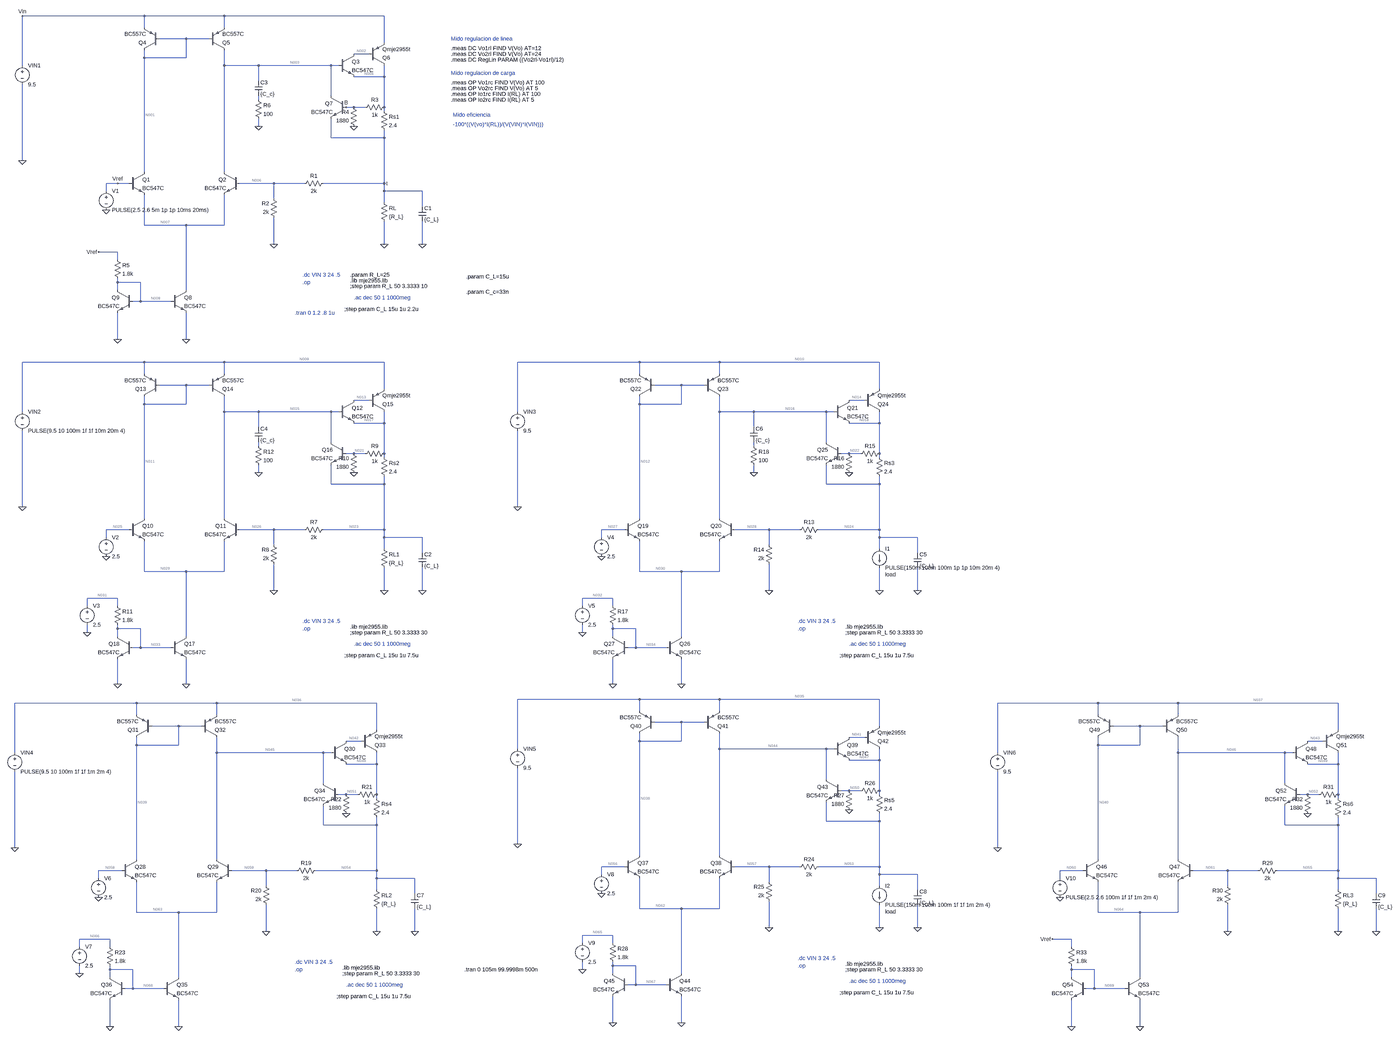
[diagram p0: schematic segundo_check_3.asc, whole sheet]
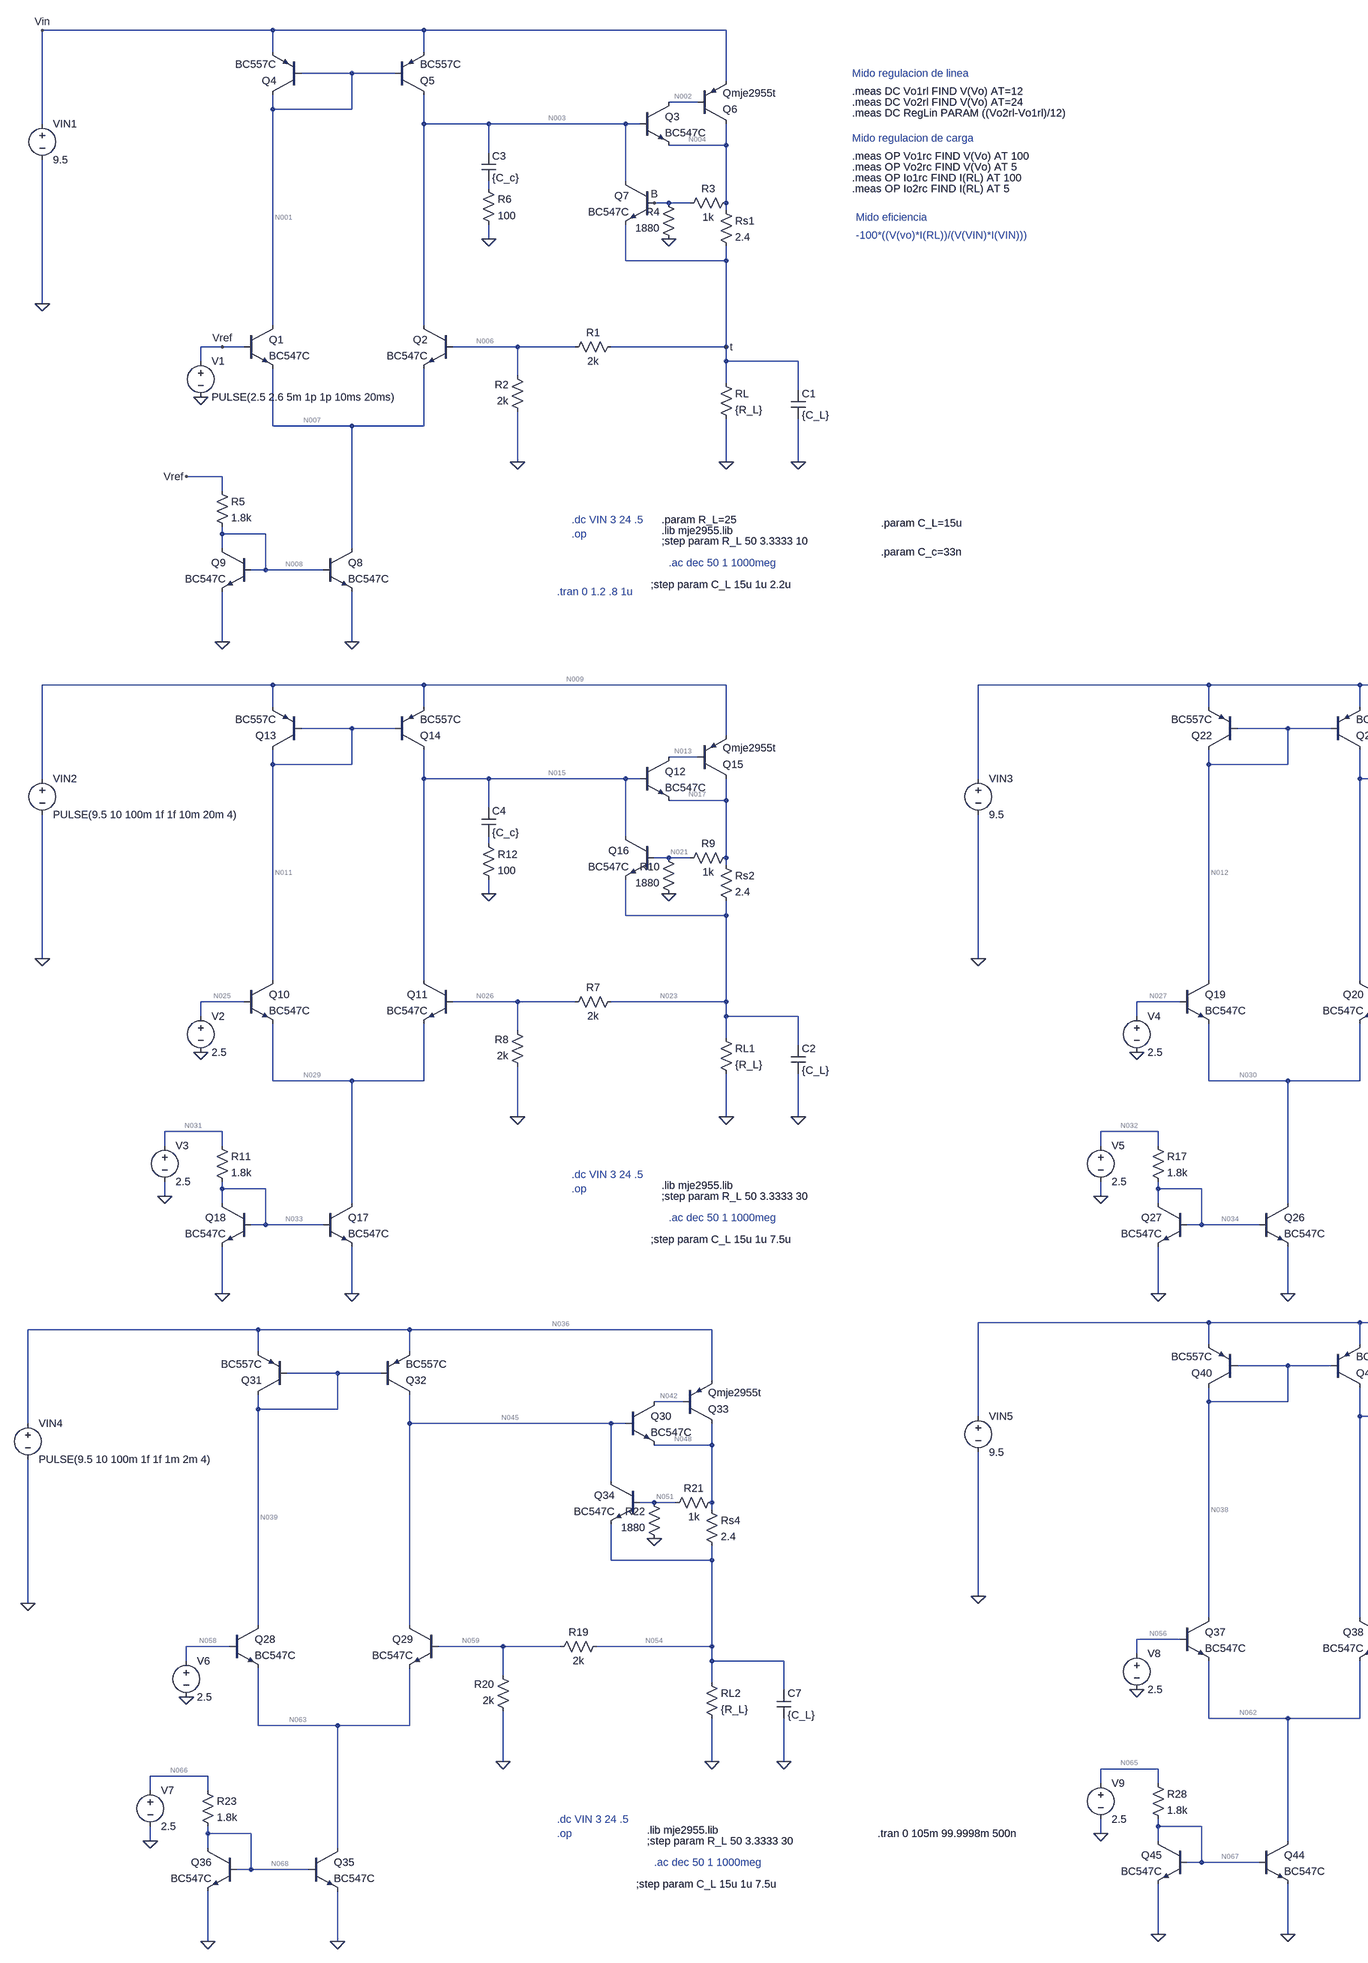
[diagram p1: schematic segundo_check_3.asc, part, row 1 of 1, column 1 of 2]
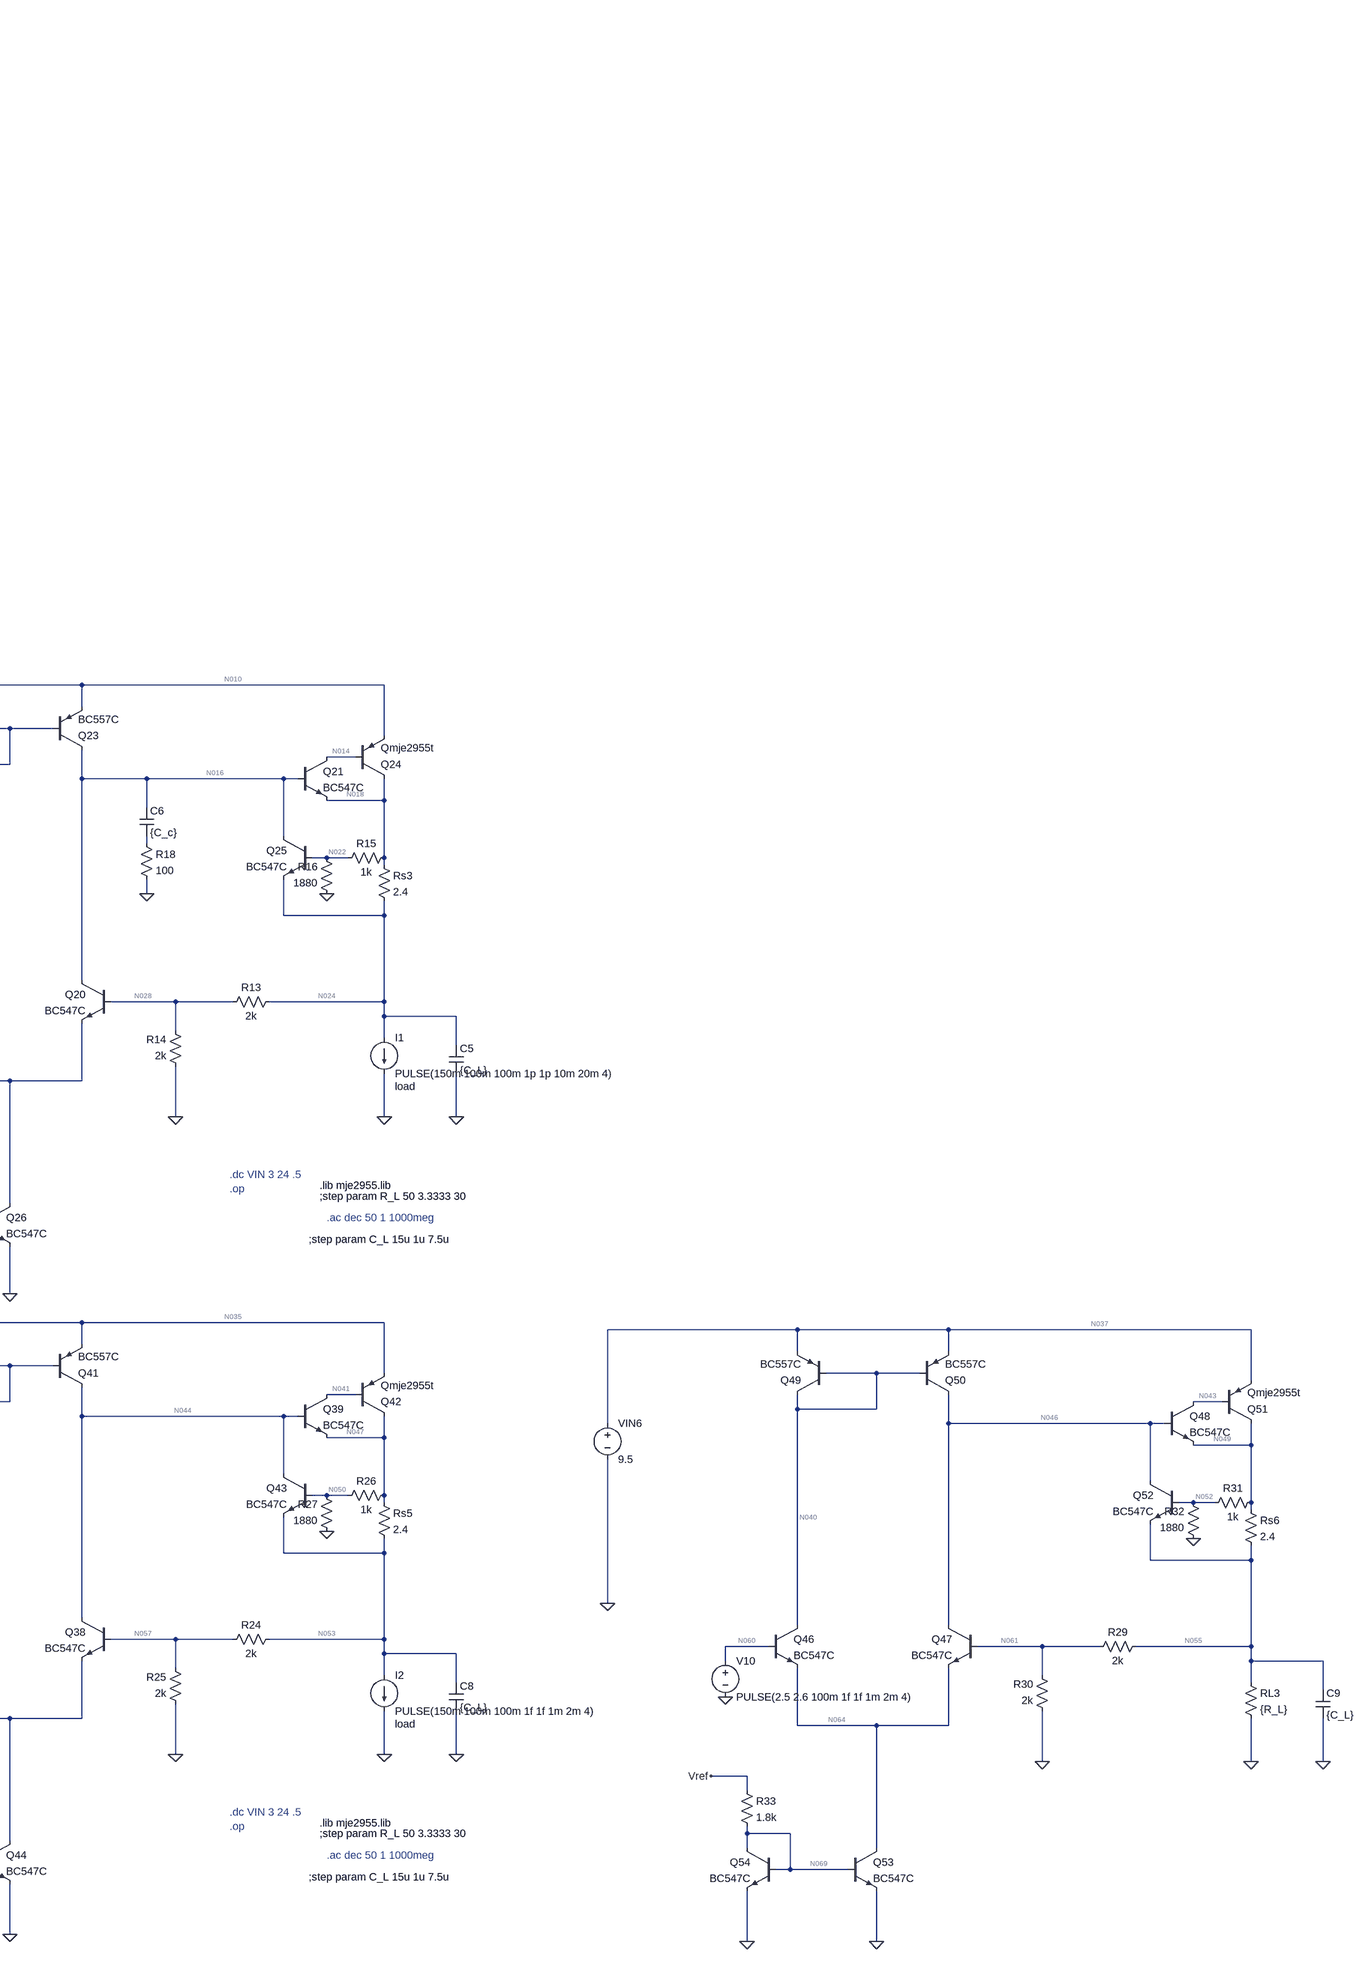
[diagram p2: schematic segundo_check_3.asc, part, row 1 of 1, column 2 of 2]
segundo_check_3.asc, the LTspice schematic file:
Version 4.1
SHEET 1 5268 3924
WIRE -80 -352 -592 -352
WIRE 256 -352 -80 -352
WIRE 928 -352 256 -352
WIRE -80 -304 -80 -352
WIRE 256 -304 256 -352
WIRE 96 -256 -16 -256
WIRE 192 -256 96 -256
WIRE 928 -240 928 -352
WIRE 864 -192 800 -192
WIRE -80 -176 -80 -208
WIRE 96 -176 96 -256
WIRE 96 -176 -80 -176
WIRE -592 -144 -592 -352
WIRE 256 -144 256 -208
WIRE 400 -144 256 -144
WIRE 704 -144 400 -144
WIRE 736 -144 704 -144
WIRE 928 -96 928 -144
WIRE 928 -96 800 -96
WIRE 400 -80 400 -144
WIRE 704 -16 704 -144
WIRE 400 0 400 -16
WIRE 800 32 768 32
WIRE 848 32 800 32
WIRE 928 32 928 -96
WIRE 928 48 928 32
WIRE 400 112 400 80
WIRE 704 160 704 80
WIRE 928 160 928 128
WIRE 928 160 704 160
WIRE -592 256 -592 -64
WIRE -80 304 -80 -176
WIRE 256 304 256 -144
WIRE -192 352 -240 352
WIRE -144 352 -192 352
WIRE 464 352 320 352
WIRE 592 352 464 352
WIRE 928 352 928 160
WIRE 928 352 672 352
WIRE -240 384 -240 352
WIRE 928 384 928 352
WIRE 1088 384 928 384
WIRE 464 416 464 352
WIRE 928 432 928 384
WIRE 1088 448 1088 384
WIRE -80 528 -80 400
WIRE 96 528 -80 528
WIRE 256 528 256 400
WIRE 256 528 96 528
WIRE 464 608 464 496
WIRE 928 608 928 512
WIRE 1088 608 1088 512
WIRE -192 640 -272 640
WIRE -192 672 -192 640
WIRE -192 768 -192 752
WIRE -96 768 -192 768
WIRE -192 800 -192 768
WIRE 96 800 96 528
WIRE -96 848 -96 768
WIRE -96 848 -128 848
WIRE 32 848 -96 848
WIRE -192 1008 -192 896
WIRE 96 1008 96 896
WIRE -80 1104 -592 1104
WIRE 256 1104 -80 1104
WIRE 928 1104 256 1104
WIRE 2000 1104 1488 1104
WIRE 2336 1104 2000 1104
WIRE 3008 1104 2336 1104
WIRE -80 1152 -80 1104
WIRE 256 1152 256 1104
WIRE 2000 1152 2000 1104
WIRE 2336 1152 2336 1104
WIRE 96 1200 -16 1200
WIRE 192 1200 96 1200
WIRE 2176 1200 2064 1200
WIRE 2272 1200 2176 1200
WIRE 928 1216 928 1104
WIRE 3008 1216 3008 1104
WIRE 864 1264 800 1264
WIRE 2944 1264 2880 1264
WIRE -80 1280 -80 1248
WIRE 96 1280 96 1200
WIRE 96 1280 -80 1280
WIRE 2000 1280 2000 1248
WIRE 2176 1280 2176 1200
WIRE 2176 1280 2000 1280
WIRE -592 1312 -592 1104
WIRE 256 1312 256 1248
WIRE 400 1312 256 1312
WIRE 704 1312 400 1312
WIRE 736 1312 704 1312
WIRE 1488 1312 1488 1104
WIRE 2336 1312 2336 1248
WIRE 2480 1312 2336 1312
WIRE 2784 1312 2480 1312
WIRE 2816 1312 2784 1312
WIRE 928 1360 928 1312
WIRE 928 1360 800 1360
WIRE 3008 1360 3008 1312
WIRE 3008 1360 2880 1360
WIRE 400 1376 400 1312
WIRE 2480 1376 2480 1312
WIRE 704 1440 704 1312
WIRE 2784 1440 2784 1312
WIRE 400 1456 400 1440
WIRE 2480 1456 2480 1440
WIRE 800 1488 768 1488
WIRE 848 1488 800 1488
WIRE 928 1488 928 1360
WIRE 2880 1488 2848 1488
WIRE 2928 1488 2880 1488
WIRE 3008 1488 3008 1360
WIRE 928 1504 928 1488
WIRE 3008 1504 3008 1488
WIRE 400 1568 400 1536
WIRE 2480 1568 2480 1536
WIRE 704 1616 704 1536
WIRE 928 1616 928 1584
WIRE 928 1616 704 1616
WIRE 2784 1616 2784 1536
WIRE 3008 1616 3008 1584
WIRE 3008 1616 2784 1616
WIRE -592 1712 -592 1392
WIRE 1488 1712 1488 1392
WIRE -80 1760 -80 1280
WIRE 256 1760 256 1312
WIRE 2000 1760 2000 1280
WIRE 2336 1760 2336 1312
WIRE -144 1808 -240 1808
WIRE 464 1808 320 1808
WIRE 592 1808 464 1808
WIRE 928 1808 928 1616
WIRE 928 1808 672 1808
WIRE 1936 1808 1840 1808
WIRE 2544 1808 2400 1808
WIRE 2672 1808 2544 1808
WIRE 3008 1808 3008 1616
WIRE 3008 1808 2752 1808
WIRE -240 1840 -240 1808
WIRE 928 1840 928 1808
WIRE 1088 1840 928 1840
WIRE 1840 1840 1840 1808
WIRE 3008 1840 3008 1808
WIRE 3168 1840 3008 1840
WIRE 464 1872 464 1808
WIRE 2544 1872 2544 1808
WIRE 928 1888 928 1840
WIRE 3008 1888 3008 1840
WIRE 1088 1904 1088 1840
WIRE 3168 1904 3168 1840
WIRE -80 1984 -80 1856
WIRE 96 1984 -80 1984
WIRE 256 1984 256 1856
WIRE 256 1984 96 1984
WIRE 2000 1984 2000 1856
WIRE 2176 1984 2000 1984
WIRE 2336 1984 2336 1856
WIRE 2336 1984 2176 1984
WIRE 464 2064 464 1952
WIRE 928 2064 928 1968
WIRE 1088 2064 1088 1968
WIRE 2544 2064 2544 1952
WIRE 3008 2064 3008 1968
WIRE 3168 2064 3168 1968
WIRE -192 2096 -320 2096
WIRE 1888 2096 1760 2096
WIRE -320 2128 -320 2096
WIRE -192 2128 -192 2096
WIRE 1760 2128 1760 2096
WIRE 1888 2128 1888 2096
WIRE -192 2224 -192 2208
WIRE -96 2224 -192 2224
WIRE 1888 2224 1888 2208
WIRE 1984 2224 1888 2224
WIRE -320 2240 -320 2208
WIRE 1760 2240 1760 2208
WIRE -192 2256 -192 2224
WIRE 96 2256 96 1984
WIRE 1888 2256 1888 2224
WIRE 2176 2256 2176 1984
WIRE -96 2304 -96 2224
WIRE -96 2304 -128 2304
WIRE 32 2304 -96 2304
WIRE 1984 2304 1984 2224
WIRE 1984 2304 1952 2304
WIRE 2112 2304 1984 2304
WIRE -192 2464 -192 2352
WIRE 96 2464 96 2352
WIRE 1888 2464 1888 2352
WIRE 2176 2464 2176 2352
WIRE 2000 2528 1488 2528
WIRE 2336 2528 2000 2528
WIRE 3008 2528 2336 2528
WIRE -112 2544 -624 2544
WIRE 224 2544 -112 2544
WIRE 896 2544 224 2544
WIRE 4016 2544 3504 2544
WIRE 4352 2544 4016 2544
WIRE 5024 2544 4352 2544
WIRE 2000 2576 2000 2528
WIRE 2336 2576 2336 2528
WIRE -112 2592 -112 2544
WIRE 224 2592 224 2544
WIRE 4016 2592 4016 2544
WIRE 4352 2592 4352 2544
WIRE 2176 2624 2064 2624
WIRE 2272 2624 2176 2624
WIRE 64 2640 -48 2640
WIRE 160 2640 64 2640
WIRE 3008 2640 3008 2528
WIRE 4192 2640 4080 2640
WIRE 4288 2640 4192 2640
WIRE 896 2656 896 2544
WIRE 5024 2656 5024 2544
WIRE 2944 2688 2880 2688
WIRE 832 2704 768 2704
WIRE 2000 2704 2000 2672
WIRE 2176 2704 2176 2624
WIRE 2176 2704 2000 2704
WIRE 4960 2704 4896 2704
WIRE -112 2720 -112 2688
WIRE 64 2720 64 2640
WIRE 64 2720 -112 2720
WIRE 4016 2720 4016 2688
WIRE 4192 2720 4192 2640
WIRE 4192 2720 4016 2720
WIRE 1488 2736 1488 2528
WIRE 2336 2736 2336 2672
WIRE 2784 2736 2336 2736
WIRE 2816 2736 2784 2736
WIRE -624 2752 -624 2544
WIRE 224 2752 224 2688
WIRE 672 2752 224 2752
WIRE 704 2752 672 2752
WIRE 3504 2752 3504 2544
WIRE 4352 2752 4352 2688
WIRE 4800 2752 4352 2752
WIRE 4832 2752 4800 2752
WIRE 3008 2784 3008 2736
WIRE 3008 2784 2880 2784
WIRE 896 2800 896 2752
WIRE 896 2800 768 2800
WIRE 5024 2800 5024 2752
WIRE 5024 2800 4896 2800
WIRE 2784 2864 2784 2736
WIRE 672 2880 672 2752
WIRE 4800 2880 4800 2752
WIRE 2880 2912 2848 2912
WIRE 2928 2912 2880 2912
WIRE 3008 2912 3008 2784
WIRE 768 2928 736 2928
WIRE 816 2928 768 2928
WIRE 896 2928 896 2800
WIRE 3008 2928 3008 2912
WIRE 4896 2928 4864 2928
WIRE 4944 2928 4896 2928
WIRE 5024 2928 5024 2800
WIRE 896 2944 896 2928
WIRE 5024 2944 5024 2928
WIRE 2784 3040 2784 2960
WIRE 3008 3040 3008 3008
WIRE 3008 3040 2784 3040
WIRE 672 3056 672 2976
WIRE 896 3056 896 3024
WIRE 896 3056 672 3056
WIRE 4800 3056 4800 2976
WIRE 5024 3056 5024 3024
WIRE 5024 3056 4800 3056
WIRE 1488 3136 1488 2816
WIRE -624 3152 -624 2832
WIRE 3504 3152 3504 2832
WIRE 2000 3184 2000 2704
WIRE 2336 3184 2336 2736
WIRE -112 3200 -112 2720
WIRE 224 3200 224 2752
WIRE 4016 3200 4016 2720
WIRE 4352 3200 4352 2752
WIRE 1936 3232 1840 3232
WIRE 2544 3232 2400 3232
WIRE 2672 3232 2544 3232
WIRE 3008 3232 3008 3040
WIRE 3008 3232 2752 3232
WIRE -176 3248 -272 3248
WIRE 432 3248 288 3248
WIRE 560 3248 432 3248
WIRE 896 3248 896 3056
WIRE 896 3248 640 3248
WIRE 3952 3248 3856 3248
WIRE 4560 3248 4416 3248
WIRE 4688 3248 4560 3248
WIRE 5024 3248 5024 3056
WIRE 5024 3248 4768 3248
WIRE 1840 3264 1840 3232
WIRE 3008 3264 3008 3232
WIRE 3168 3264 3008 3264
WIRE -272 3280 -272 3248
WIRE 896 3280 896 3248
WIRE 1056 3280 896 3280
WIRE 3856 3280 3856 3248
WIRE 5024 3280 5024 3248
WIRE 5184 3280 5024 3280
WIRE 2544 3296 2544 3232
WIRE 432 3312 432 3248
WIRE 3008 3312 3008 3264
WIRE 4560 3312 4560 3248
WIRE 896 3328 896 3280
WIRE 3168 3328 3168 3264
WIRE 5024 3328 5024 3280
WIRE 1056 3344 1056 3280
WIRE 5184 3344 5184 3280
WIRE 2000 3408 2000 3280
WIRE 2176 3408 2000 3408
WIRE 2336 3408 2336 3280
WIRE 2336 3408 2176 3408
WIRE -112 3424 -112 3296
WIRE 64 3424 -112 3424
WIRE 224 3424 224 3296
WIRE 224 3424 64 3424
WIRE 4016 3424 4016 3296
WIRE 4192 3424 4016 3424
WIRE 4352 3424 4352 3296
WIRE 4352 3424 4192 3424
WIRE 2544 3488 2544 3376
WIRE 3008 3488 3008 3392
WIRE 3168 3488 3168 3392
WIRE 432 3504 432 3392
WIRE 896 3504 896 3408
WIRE 1056 3504 1056 3408
WIRE 4560 3504 4560 3392
WIRE 5024 3504 5024 3408
WIRE 5184 3504 5184 3408
WIRE 1888 3520 1760 3520
WIRE -224 3536 -352 3536
WIRE 3904 3536 3824 3536
WIRE 1760 3552 1760 3520
WIRE 1888 3552 1888 3520
WIRE -352 3568 -352 3536
WIRE -224 3568 -224 3536
WIRE 3904 3568 3904 3536
WIRE 1888 3648 1888 3632
WIRE 1984 3648 1888 3648
WIRE -224 3664 -224 3648
WIRE -128 3664 -224 3664
WIRE 1760 3664 1760 3632
WIRE 3904 3664 3904 3648
WIRE 4000 3664 3904 3664
WIRE -352 3680 -352 3648
WIRE 1888 3680 1888 3648
WIRE 2176 3680 2176 3408
WIRE -224 3696 -224 3664
WIRE 64 3696 64 3424
WIRE 3904 3696 3904 3664
WIRE 4192 3696 4192 3424
WIRE 1984 3728 1984 3648
WIRE 1984 3728 1952 3728
WIRE 2112 3728 1984 3728
WIRE -128 3744 -128 3664
WIRE -128 3744 -160 3744
WIRE 0 3744 -128 3744
WIRE 4000 3744 4000 3664
WIRE 4000 3744 3968 3744
WIRE 4128 3744 4000 3744
WIRE 1888 3888 1888 3776
WIRE 2176 3888 2176 3776
WIRE -224 3904 -224 3792
WIRE 64 3904 64 3792
WIRE 3904 3904 3904 3792
WIRE 4192 3904 4192 3792
FLAG -240 464 0
FLAG 928 608 0
FLAG -592 256 0
FLAG 464 608 0
FLAG 800 112 0
FLAG 768 32 B
FLAG -192 352 Vref
FLAG 96 1008 0
FLAG -592 -352 Vin
FLAG -192 1008 0
FLAG -272 640 Vref
FLAG 1088 608 0
FLAG 928 352 t
FLAG 400 112 0
FLAG -240 1920 0
FLAG 928 2064 0
FLAG -592 1712 0
FLAG 464 2064 0
FLAG 800 1568 0
FLAG 96 2464 0
FLAG -192 2464 0
FLAG 1088 2064 0
FLAG 400 1568 0
FLAG -320 2240 0
FLAG 1840 1920 0
FLAG 3008 2064 0
FLAG 1488 1712 0
FLAG 2544 2064 0
FLAG 2880 1568 0
FLAG 2176 2464 0
FLAG 1888 2464 0
FLAG 3168 2064 0
FLAG 2480 1568 0
FLAG 1760 2240 0
FLAG -272 3360 0
FLAG 896 3504 0
FLAG -624 3152 0
FLAG 432 3504 0
FLAG 768 3008 0
FLAG 64 3904 0
FLAG -224 3904 0
FLAG 1056 3504 0
FLAG -352 3680 0
FLAG 1840 3344 0
FLAG 3008 3488 0
FLAG 1488 3136 0
FLAG 2544 3488 0
FLAG 2880 2992 0
FLAG 2176 3888 0
FLAG 1888 3888 0
FLAG 3168 3488 0
FLAG 1760 3664 0
FLAG 3856 3360 0
FLAG 5024 3504 0
FLAG 3504 3152 0
FLAG 4560 3504 0
FLAG 4896 3008 0
FLAG 4192 3904 0
FLAG 3904 3904 0
FLAG 3824 3536 Vref
FLAG 5184 3504 0
SYMBOL npn -144 304 R0
SYMATTR InstName Q1
SYMATTR Value BC547C
SYMBOL npn 320 304 M0
SYMATTR InstName Q2
SYMATTR Value BC547C
SYMBOL npn 736 -192 R0
SYMATTR InstName Q3
SYMATTR Value BC547C
SYMBOL pnp -16 -208 R180
SYMATTR InstName Q4
SYMATTR Value BC557C
SYMBOL pnp 192 -208 M180
SYMATTR InstName Q5
SYMATTR Value BC557C
SYMBOL voltage -240 368 R0
WINDOW 123 24 124 Left 2
WINDOW 39 0 0 Left 0
SYMATTR InstName V1
SYMATTR Value PULSE(2.5 2.6 5m 1p 1p 10ms 20ms)
SYMBOL voltage -592 -160 R0
WINDOW 123 0 0 Left 0
WINDOW 39 0 0 Left 0
SYMATTR InstName VIN1
SYMATTR Value 9.5
SYMBOL pnp 864 -144 M180
SYMATTR InstName Q6
SYMATTR Value Qmje2955t
SYMBOL res 688 336 R90
WINDOW 0 0 56 VBottom 2
WINDOW 3 32 56 VTop 2
SYMATTR InstName R1
SYMATTR Value 2k
SYMBOL res 480 512 R180
WINDOW 0 36 76 Left 2
WINDOW 3 36 40 Left 2
SYMATTR InstName R2
SYMATTR Value 2k
SYMBOL npn 768 -16 M0
SYMATTR InstName Q7
SYMATTR Value BC547C
SYMBOL res 912 32 R0
SYMATTR InstName Rs1
SYMATTR Value 2.4
SYMBOL res 944 16 R90
WINDOW 0 0 56 VBottom 2
WINDOW 3 32 56 VTop 2
SYMATTR InstName R3
SYMATTR Value 1k
SYMBOL res 816 128 R180
WINDOW 0 36 76 Left 2
WINDOW 3 36 40 Left 2
SYMATTR InstName R4
SYMATTR Value 1880
SYMBOL npn 32 800 R0
SYMATTR InstName Q8
SYMATTR Value BC547C
SYMBOL npn -128 800 M0
SYMATTR InstName Q9
SYMATTR Value BC547C
SYMBOL res -208 656 R0
SYMATTR InstName R5
SYMATTR Value 1.8k
SYMBOL cap 1072 448 R0
SYMATTR InstName C1
SYMATTR Value {C_L}
SYMBOL cap 384 -80 R0
SYMATTR InstName C3
SYMATTR Value {C_c}
SYMBOL res 912 416 R0
SYMATTR InstName RL
SYMATTR Value {R_L}
SYMBOL res 384 -16 R0
SYMATTR InstName R6
SYMATTR Value 100
SYMBOL npn -144 1760 R0
SYMATTR InstName Q10
SYMATTR Value BC547C
SYMBOL npn 320 1760 M0
SYMATTR InstName Q11
SYMATTR Value BC547C
SYMBOL npn 736 1264 R0
SYMATTR InstName Q12
SYMATTR Value BC547C
SYMBOL pnp -16 1248 R180
SYMATTR InstName Q13
SYMATTR Value BC557C
SYMBOL pnp 192 1248 M180
SYMATTR InstName Q14
SYMATTR Value BC557C
SYMBOL voltage -240 1824 R0
WINDOW 123 24 124 Left 2
WINDOW 39 0 0 Left 0
SYMATTR InstName V2
SYMATTR Value 2.5
SYMBOL voltage -592 1296 R0
WINDOW 123 0 0 Left 0
WINDOW 39 0 0 Left 0
SYMATTR InstName VIN2
SYMATTR Value PULSE(9.5 10 100m 1f 1f 10m 20m 4)
SYMBOL pnp 864 1312 M180
SYMATTR InstName Q15
SYMATTR Value Qmje2955t
SYMBOL res 688 1792 R90
WINDOW 0 0 56 VBottom 2
WINDOW 3 32 56 VTop 2
SYMATTR InstName R7
SYMATTR Value 2k
SYMBOL res 480 1968 R180
WINDOW 0 36 76 Left 2
WINDOW 3 36 40 Left 2
SYMATTR InstName R8
SYMATTR Value 2k
SYMBOL npn 768 1440 M0
SYMATTR InstName Q16
SYMATTR Value BC547C
SYMBOL res 912 1488 R0
SYMATTR InstName Rs2
SYMATTR Value 2.4
SYMBOL res 944 1472 R90
WINDOW 0 0 56 VBottom 2
WINDOW 3 32 56 VTop 2
SYMATTR InstName R9
SYMATTR Value 1k
SYMBOL res 816 1584 R180
WINDOW 0 36 76 Left 2
WINDOW 3 36 40 Left 2
SYMATTR InstName R10
SYMATTR Value 1880
SYMBOL npn 32 2256 R0
SYMATTR InstName Q17
SYMATTR Value BC547C
SYMBOL npn -128 2256 M0
SYMATTR InstName Q18
SYMATTR Value BC547C
SYMBOL res -208 2112 R0
SYMATTR InstName R11
SYMATTR Value 1.8k
SYMBOL cap 1072 1904 R0
SYMATTR InstName C2
SYMATTR Value {C_L}
SYMBOL cap 384 1376 R0
SYMATTR InstName C4
SYMATTR Value {C_c}
SYMBOL res 912 1872 R0
SYMATTR InstName RL1
SYMATTR Value {R_L}
SYMBOL res 384 1440 R0
SYMATTR InstName R12
SYMATTR Value 100
SYMBOL voltage -320 2112 R0
WINDOW 123 24 124 Left 2
WINDOW 39 0 0 Left 0
SYMATTR InstName V3
SYMATTR Value 2.5
SYMBOL npn 1936 1760 R0
SYMATTR InstName Q19
SYMATTR Value BC547C
SYMBOL npn 2400 1760 M0
SYMATTR InstName Q20
SYMATTR Value BC547C
SYMBOL npn 2816 1264 R0
SYMATTR InstName Q21
SYMATTR Value BC547C
SYMBOL pnp 2064 1248 R180
SYMATTR InstName Q22
SYMATTR Value BC557C
SYMBOL pnp 2272 1248 M180
SYMATTR InstName Q23
SYMATTR Value BC557C
SYMBOL voltage 1840 1824 R0
WINDOW 123 24 124 Left 2
WINDOW 39 0 0 Left 0
SYMATTR InstName V4
SYMATTR Value 2.5
SYMBOL voltage 1488 1296 R0
WINDOW 123 0 0 Left 0
WINDOW 39 0 0 Left 0
SYMATTR InstName VIN3
SYMATTR Value 9.5
SYMBOL pnp 2944 1312 M180
SYMATTR InstName Q24
SYMATTR Value Qmje2955t
SYMBOL res 2768 1792 R90
WINDOW 0 0 56 VBottom 2
WINDOW 3 32 56 VTop 2
SYMATTR InstName R13
SYMATTR Value 2k
SYMBOL res 2560 1968 R180
WINDOW 0 36 76 Left 2
WINDOW 3 36 40 Left 2
SYMATTR InstName R14
SYMATTR Value 2k
SYMBOL npn 2848 1440 M0
SYMATTR InstName Q25
SYMATTR Value BC547C
SYMBOL res 2992 1488 R0
SYMATTR InstName Rs3
SYMATTR Value 2.4
SYMBOL res 3024 1472 R90
WINDOW 0 0 56 VBottom 2
WINDOW 3 32 56 VTop 2
SYMATTR InstName R15
SYMATTR Value 1k
SYMBOL res 2896 1584 R180
WINDOW 0 36 76 Left 2
WINDOW 3 36 40 Left 2
SYMATTR InstName R16
SYMATTR Value 1880
SYMBOL npn 2112 2256 R0
SYMATTR InstName Q26
SYMATTR Value BC547C
SYMBOL npn 1952 2256 M0
SYMATTR InstName Q27
SYMATTR Value BC547C
SYMBOL res 1872 2112 R0
SYMATTR InstName R17
SYMATTR Value 1.8k
SYMBOL cap 3152 1904 R0
SYMATTR InstName C5
SYMATTR Value {C_L}
SYMBOL cap 2464 1376 R0
SYMATTR InstName C6
SYMATTR Value {C_c}
SYMBOL res 2464 1440 R0
SYMATTR InstName R18
SYMATTR Value 100
SYMBOL voltage 1760 2112 R0
WINDOW 123 24 124 Left 2
WINDOW 39 0 0 Left 0
SYMATTR InstName V5
SYMATTR Value 2.5
SYMBOL current 3008 1888 R0
WINDOW 123 0 0 Left 0
WINDOW 39 24 108 Left 2
SYMATTR SpiceLine load
SYMATTR InstName I1
SYMATTR Value PULSE(150m 100m 100m 1p 1p 10m 20m 4)
SYMBOL npn -176 3200 R0
SYMATTR InstName Q28
SYMATTR Value BC547C
SYMBOL npn 288 3200 M0
SYMATTR InstName Q29
SYMATTR Value BC547C
SYMBOL npn 704 2704 R0
SYMATTR InstName Q30
SYMATTR Value BC547C
SYMBOL pnp -48 2688 R180
SYMATTR InstName Q31
SYMATTR Value BC557C
SYMBOL pnp 160 2688 M180
SYMATTR InstName Q32
SYMATTR Value BC557C
SYMBOL voltage -272 3264 R0
WINDOW 123 24 124 Left 2
WINDOW 39 0 0 Left 0
SYMATTR InstName V6
SYMATTR Value 2.5
SYMBOL voltage -624 2736 R0
WINDOW 123 0 0 Left 0
WINDOW 39 0 0 Left 0
SYMATTR InstName VIN4
SYMATTR Value PULSE(9.5 10 100m 1f 1f 1m 2m 4)
SYMBOL pnp 832 2752 M180
SYMATTR InstName Q33
SYMATTR Value Qmje2955t
SYMBOL res 656 3232 R90
WINDOW 0 0 56 VBottom 2
WINDOW 3 32 56 VTop 2
SYMATTR InstName R19
SYMATTR Value 2k
SYMBOL res 448 3408 R180
WINDOW 0 36 76 Left 2
WINDOW 3 36 40 Left 2
SYMATTR InstName R20
SYMATTR Value 2k
SYMBOL npn 736 2880 M0
SYMATTR InstName Q34
SYMATTR Value BC547C
SYMBOL res 880 2928 R0
SYMATTR InstName Rs4
SYMATTR Value 2.4
SYMBOL res 912 2912 R90
WINDOW 0 0 56 VBottom 2
WINDOW 3 32 56 VTop 2
SYMATTR InstName R21
SYMATTR Value 1k
SYMBOL res 784 3024 R180
WINDOW 0 36 76 Left 2
WINDOW 3 36 40 Left 2
SYMATTR InstName R22
SYMATTR Value 1880
SYMBOL npn 0 3696 R0
SYMATTR InstName Q35
SYMATTR Value BC547C
SYMBOL npn -160 3696 M0
SYMATTR InstName Q36
SYMATTR Value BC547C
SYMBOL res -240 3552 R0
SYMATTR InstName R23
SYMATTR Value 1.8k
SYMBOL cap 1040 3344 R0
SYMATTR InstName C7
SYMATTR Value {C_L}
SYMBOL res 880 3312 R0
SYMATTR InstName RL2
SYMATTR Value {R_L}
SYMBOL voltage -352 3552 R0
WINDOW 123 24 124 Left 2
WINDOW 39 0 0 Left 0
SYMATTR InstName V7
SYMATTR Value 2.5
SYMBOL npn 1936 3184 R0
SYMATTR InstName Q37
SYMATTR Value BC547C
SYMBOL npn 2400 3184 M0
SYMATTR InstName Q38
SYMATTR Value BC547C
SYMBOL npn 2816 2688 R0
SYMATTR InstName Q39
SYMATTR Value BC547C
SYMBOL pnp 2064 2672 R180
SYMATTR InstName Q40
SYMATTR Value BC557C
SYMBOL pnp 2272 2672 M180
SYMATTR InstName Q41
SYMATTR Value BC557C
SYMBOL voltage 1840 3248 R0
WINDOW 123 24 124 Left 2
WINDOW 39 0 0 Left 0
SYMATTR InstName V8
SYMATTR Value 2.5
SYMBOL voltage 1488 2720 R0
WINDOW 123 0 0 Left 0
WINDOW 39 0 0 Left 0
SYMATTR InstName VIN5
SYMATTR Value 9.5
SYMBOL pnp 2944 2736 M180
SYMATTR InstName Q42
SYMATTR Value Qmje2955t
SYMBOL res 2768 3216 R90
WINDOW 0 0 56 VBottom 2
WINDOW 3 32 56 VTop 2
SYMATTR InstName R24
SYMATTR Value 2k
SYMBOL res 2560 3392 R180
WINDOW 0 36 76 Left 2
WINDOW 3 36 40 Left 2
SYMATTR InstName R25
SYMATTR Value 2k
SYMBOL npn 2848 2864 M0
SYMATTR InstName Q43
SYMATTR Value BC547C
SYMBOL res 2992 2912 R0
SYMATTR InstName Rs5
SYMATTR Value 2.4
SYMBOL res 3024 2896 R90
WINDOW 0 0 56 VBottom 2
WINDOW 3 32 56 VTop 2
SYMATTR InstName R26
SYMATTR Value 1k
SYMBOL res 2896 3008 R180
WINDOW 0 36 76 Left 2
WINDOW 3 36 40 Left 2
SYMATTR InstName R27
SYMATTR Value 1880
SYMBOL npn 2112 3680 R0
SYMATTR InstName Q44
SYMATTR Value BC547C
SYMBOL npn 1952 3680 M0
SYMATTR InstName Q45
SYMATTR Value BC547C
SYMBOL res 1872 3536 R0
SYMATTR InstName R28
SYMATTR Value 1.8k
SYMBOL cap 3152 3328 R0
SYMATTR InstName C8
SYMATTR Value {C_L}
SYMBOL voltage 1760 3536 R0
WINDOW 123 24 124 Left 2
WINDOW 39 0 0 Left 0
SYMATTR InstName V9
SYMATTR Value 2.5
SYMBOL current 3008 3312 R0
WINDOW 123 0 0 Left 0
WINDOW 39 24 108 Left 2
SYMATTR SpiceLine load
SYMATTR InstName I2
SYMATTR Value PULSE(150m 100m 100m 1f 1f 1m 2m 4)
SYMBOL npn 3952 3200 R0
SYMATTR InstName Q46
SYMATTR Value BC547C
SYMBOL npn 4416 3200 M0
SYMATTR InstName Q47
SYMATTR Value BC547C
SYMBOL npn 4832 2704 R0
SYMATTR InstName Q48
SYMATTR Value BC547C
SYMBOL pnp 4080 2688 R180
SYMATTR InstName Q49
SYMATTR Value BC557C
SYMBOL pnp 4288 2688 M180
SYMATTR InstName Q50
SYMATTR Value BC557C
SYMBOL voltage 3856 3264 R0
WINDOW 123 24 124 Left 2
WINDOW 39 0 0 Left 0
SYMATTR InstName V10
SYMATTR Value PULSE(2.5 2.6 100m 1f 1f 1m 2m 4)
SYMBOL voltage 3504 2736 R0
WINDOW 123 0 0 Left 0
WINDOW 39 0 0 Left 0
SYMATTR InstName VIN6
SYMATTR Value 9.5
SYMBOL pnp 4960 2752 M180
SYMATTR InstName Q51
SYMATTR Value Qmje2955t
SYMBOL res 4784 3232 R90
WINDOW 0 0 56 VBottom 2
WINDOW 3 32 56 VTop 2
SYMATTR InstName R29
SYMATTR Value 2k
SYMBOL res 4576 3408 R180
WINDOW 0 36 76 Left 2
WINDOW 3 36 40 Left 2
SYMATTR InstName R30
SYMATTR Value 2k
SYMBOL npn 4864 2880 M0
SYMATTR InstName Q52
SYMATTR Value BC547C
SYMBOL res 5008 2928 R0
SYMATTR InstName Rs6
SYMATTR Value 2.4
SYMBOL res 5040 2912 R90
WINDOW 0 0 56 VBottom 2
WINDOW 3 32 56 VTop 2
SYMATTR InstName R31
SYMATTR Value 1k
SYMBOL res 4912 3024 R180
WINDOW 0 36 76 Left 2
WINDOW 3 36 40 Left 2
SYMATTR InstName R32
SYMATTR Value 1880
SYMBOL npn 4128 3696 R0
SYMATTR InstName Q53
SYMATTR Value BC547C
SYMBOL npn 3968 3696 M0
SYMATTR InstName Q54
SYMATTR Value BC547C
SYMBOL res 3888 3552 R0
SYMATTR InstName R33
SYMATTR Value 1.8k
SYMBOL cap 5168 3344 R0
SYMATTR InstName C9
SYMATTR Value {C_L}
SYMBOL res 5008 3312 R0
SYMATTR InstName RL3
SYMATTR Value {R_L}
TEXT 784 736 Left 2 !.param R_L=25
TEXT 784 760 Left 2 !.lib mje2955.lib
TEXT 584 736 Left 2 ;.dc VIN 3 24 .5
TEXT 784 784 Left 2 !;step param R_L 50 3.3333 10
TEXT 584 768 Left 2 ;.op
TEXT 1208 -256 Left 2 ;Mido regulacion de linea
TEXT 1208 -216 Left 2 !.meas DC Vo1rl FIND V(Vo) AT=12
TEXT 1208 -192 Left 2 !.meas DC Vo2rl FIND V(Vo) AT=24
TEXT 1208 -168 Left 2 !.meas DC RegLin PARAM ((Vo2rl-Vo1rl)/12)
TEXT 1208 -112 Left 2 ;Mido regulacion de carga
TEXT 1208 -72 Left 2 !.meas OP Vo1rc FIND V(Vo) AT 100
TEXT 1208 -48 Left 2 !.meas OP Vo2rc FIND V(Vo) AT 5
TEXT 1208 -24 Left 2 !.meas OP Io1rc FIND I(RL) AT 100
TEXT 1208 0 Left 2 !.meas OP Io2rc FIND I(RL) AT 5
TEXT 1216 64 Left 2 ;Mido eficiencia
TEXT 1216 104 Left 2 ;-100*((V(vo)*I(RL))/(V(VIN)*I(VIN)))
TEXT 552 896 Left 2 ;.tran 0 1.2 .8 1u
TEXT 800 832 Left 2 ;.ac dec 50 1 1000meg
TEXT 760 880 Left 2 !;step param C_L 15u 1u 2.2u
TEXT 1272 744 Left 2 !.param C_L=15u
TEXT 784 2216 Left 2 !.lib mje2955.lib
TEXT 584 2192 Left 2 ;.dc VIN 3 24 .5
TEXT 784 2240 Left 2 !;step param R_L 50 3.3333 30
TEXT 584 2224 Left 2 ;.op
TEXT 1264 3664 Left 2 !.tran 0 105m 99.9998m 500n
TEXT 800 2288 Left 2 ;.ac dec 50 1 1000meg
TEXT 760 2336 Left 2 !;step param C_L 15u 1u 7.5u
TEXT 2864 2216 Left 2 !.lib mje2955.lib
TEXT 2664 2192 Left 2 ;.dc VIN 3 24 .5
TEXT 2864 2240 Left 2 !;step param R_L 50 3.3333 30
TEXT 2664 2224 Left 2 ;.op
TEXT 2880 2288 Left 2 ;.ac dec 50 1 1000meg
TEXT 2840 2336 Left 2 !;step param C_L 15u 1u 7.5u
TEXT 1272 808 Left 2 !.param C_c=33n
TEXT 752 3656 Left 2 !.lib mje2955.lib
TEXT 552 3632 Left 2 ;.dc VIN 3 24 .5
TEXT 752 3680 Left 2 !;step param R_L 50 3.3333 30
TEXT 552 3664 Left 2 ;.op
TEXT 768 3728 Left 2 ;.ac dec 50 1 1000meg
TEXT 728 3776 Left 2 !;step param C_L 15u 1u 7.5u
TEXT 2864 3640 Left 2 !.lib mje2955.lib
TEXT 2664 3616 Left 2 ;.dc VIN 3 24 .5
TEXT 2864 3664 Left 2 !;step param R_L 50 3.3333 30
TEXT 2664 3648 Left 2 ;.op
TEXT 2880 3712 Left 2 ;.ac dec 50 1 1000meg
TEXT 2840 3760 Left 2 !;step param C_L 15u 1u 7.5u

The netlist it stands for:
* segundo_check_3.asc
Q1 N001 Vref N007 0 BC547C
Q2 N003 N006 N007 0 BC547C
Q3 N002 N003 N004 0 BC547C
Q4 N001 N001 Vin 0 BC557C
Q5 N003 N001 Vin 0 BC557C
V1 Vref 0 PULSE(2.5 2.6 5m 1p 1p 10ms 20ms)
VIN1 Vin 0 9.5
Q6 N004 N002 Vin 0 Qmje2955t
R1 t N006 2k
R2 0 N006 2k
Q7 N003 B t 0 BC547C
Rs1 N004 t 2.4
R3 N004 B 1k
R4 0 B 1880
Q8 N007 N008 0 0 BC547C
Q9 N008 N008 0 0 BC547C
R5 Vref N008 1.8k
C1 t 0 {C_L}
C3 N003 N005 {C_c}
RL t 0 {R_L}
R6 N005 0 100
Q10 N011 N025 N029 0 BC547C
Q11 N015 N026 N029 0 BC547C
Q12 N013 N015 N017 0 BC547C
Q13 N011 N011 N009 0 BC557C
Q14 N015 N011 N009 0 BC557C
V2 N025 0 2.5
VIN2 N009 0 PULSE(9.5 10 100m 1f 1f 10m 20m 4)
Q15 N017 N013 N009 0 Qmje2955t
R7 N023 N026 2k
R8 0 N026 2k
Q16 N015 N021 N023 0 BC547C
Rs2 N017 N023 2.4
R9 N017 N021 1k
R10 0 N021 1880
Q17 N029 N033 0 0 BC547C
Q18 N033 N033 0 0 BC547C
R11 N031 N033 1.8k
C2 N023 0 {C_L}
C4 N015 N019 {C_c}
RL1 N023 0 {R_L}
R12 N019 0 100
V3 N031 0 2.5
Q19 N012 N027 N030 0 BC547C
Q20 N016 N028 N030 0 BC547C
Q21 N014 N016 N018 0 BC547C
Q22 N012 N012 N010 0 BC557C
Q23 N016 N012 N010 0 BC557C
V4 N027 0 2.5
VIN3 N010 0 9.5
Q24 N018 N014 N010 0 Qmje2955t
R13 N024 N028 2k
R14 0 N028 2k
Q25 N016 N022 N024 0 BC547C
Rs3 N018 N024 2.4
R15 N018 N022 1k
R16 0 N022 1880
Q26 N030 N034 0 0 BC547C
Q27 N034 N034 0 0 BC547C
R17 N032 N034 1.8k
C5 N024 0 {C_L}
C6 N016 N020 {C_c}
R18 N020 0 100
V5 N032 0 2.5
I1 N024 0 PULSE(150m 100m 100m 1p 1p 10m 20m 4) load
Q28 N039 N058 N063 0 BC547C
Q29 N045 N059 N063 0 BC547C
Q30 N042 N045 N048 0 BC547C
Q31 N039 N039 N036 0 BC557C
Q32 N045 N039 N036 0 BC557C
V6 N058 0 2.5
VIN4 N036 0 PULSE(9.5 10 100m 1f 1f 1m 2m 4)
Q33 N048 N042 N036 0 Qmje2955t
R19 N054 N059 2k
R20 0 N059 2k
Q34 N045 N051 N054 0 BC547C
Rs4 N048 N054 2.4
R21 N048 N051 1k
R22 0 N051 1880
Q35 N063 N068 0 0 BC547C
Q36 N068 N068 0 0 BC547C
R23 N066 N068 1.8k
C7 N054 0 {C_L}
RL2 N054 0 {R_L}
V7 N066 0 2.5
Q37 N038 N056 N062 0 BC547C
Q38 N044 N057 N062 0 BC547C
Q39 N041 N044 N047 0 BC547C
Q40 N038 N038 N035 0 BC557C
Q41 N044 N038 N035 0 BC557C
V8 N056 0 2.5
VIN5 N035 0 9.5
Q42 N047 N041 N035 0 Qmje2955t
R24 N053 N057 2k
R25 0 N057 2k
Q43 N044 N050 N053 0 BC547C
Rs5 N047 N053 2.4
R26 N047 N050 1k
R27 0 N050 1880
Q44 N062 N067 0 0 BC547C
Q45 N067 N067 0 0 BC547C
R28 N065 N067 1.8k
C8 N053 0 {C_L}
V9 N065 0 2.5
I2 N053 0 PULSE(150m 100m 100m 1f 1f 1m 2m 4) load
Q46 N040 N060 N064 0 BC547C
Q47 N046 N061 N064 0 BC547C
Q48 N043 N046 N049 0 BC547C
Q49 N040 N040 N037 0 BC557C
Q50 N046 N040 N037 0 BC557C
V10 N060 0 PULSE(2.5 2.6 100m 1f 1f 1m 2m 4)
VIN6 N037 0 9.5
Q51 N049 N043 N037 0 Qmje2955t
R29 N055 N061 2k
R30 0 N061 2k
Q52 N046 N052 N055 0 BC547C
Rs6 N049 N055 2.4
R31 N049 N052 1k
R32 0 N052 1880
Q53 N064 N069 0 0 BC547C
Q54 N069 N069 0 0 BC547C
R33 Vref N069 1.8k
C9 N055 0 {C_L}
RL3 N055 0 {R_L}
.model NPN NPN
.model PNP PNP
.lib standard.bjt
.param R_L=25
.lib mje2955.lib
* .dc VIN 3 24 .5
;step param R_L 50 3.3333 10
* .op
* Mido regulacion de linea
.meas DC Vo1rl FIND V(Vo) AT=12
.meas DC Vo2rl FIND V(Vo) AT=24
.meas DC RegLin PARAM ((Vo2rl-Vo1rl)/12)
* Mido regulacion de carga
.meas OP Vo1rc FIND V(Vo) AT 100
.meas OP Vo2rc FIND V(Vo) AT 5
.meas OP Io1rc FIND I(RL) AT 100
.meas OP Io2rc FIND I(RL) AT 5
* Mido eficiencia
* -100*((V(vo)*I(RL))/(V(VIN)*I(VIN)))
* .tran 0 1.2 .8 1u
* .ac dec 50 1 1000meg
;step param C_L 15u 1u 2.2u
.param C_L=15u
.lib mje2955.lib
* .dc VIN 3 24 .5
;step param R_L 50 3.3333 30
* .op
.tran 0 105m 99.9998m 500n
* .ac dec 50 1 1000meg
;step param C_L 15u 1u 7.5u
.lib mje2955.lib
* .dc VIN 3 24 .5
;step param R_L 50 3.3333 30
* .op
* .ac dec 50 1 1000meg
;step param C_L 15u 1u 7.5u
.param C_c=33n
.lib mje2955.lib
* .dc VIN 3 24 .5
;step param R_L 50 3.3333 30
* .op
* .ac dec 50 1 1000meg
;step param C_L 15u 1u 7.5u
.lib mje2955.lib
* .dc VIN 3 24 .5
;step param R_L 50 3.3333 30
* .op
* .ac dec 50 1 1000meg
;step param C_L 15u 1u 7.5u
.backanno
.end

* Results of the author's LTspice run, read from the files saved beside the schematic
* Operating Point, zero values left out:
*   V(n006) = 2.504 V
*   V(n011) = 8.9 V
*   V(n013) = 9.024 V
*   V(n012) = 8.9 V
*   V(n024) = 5.01 V
*   V(n039) = 8.9 V
*   V(n054) = 5.01 V
*   V(n050) = 3.508 V
*   V(n043) = 9.024 V
*   V(n069) = 622.9 mV
*   V(n056) = 2.5 V
*   V(vref) = 2.5 V
*   V(b) = 3.586 V
*   V(n033) = 622.9 mV
*   V(n014) = 9.039 V
*   V(n034) = 622.9 mV
*   V(n042) = 9.024 V
*   V(n047) = 5.373 V
*   V(n064) = 1.899 V
*   V(n004) = 5.494 V
*   V(n029) = 1.899 V
*   V(n009) = 9.5 V
*   V(n030) = 1.899 V
*   V(n063) = 1.899 V
*   V(n068) = 622.9 mV
*   V(n044) = 6.001 V
*   V(n065) = 2.5 V
*   V(n037) = 9.5 V
*   V(n003) = 6.128 V
*   V(n010) = 9.5 V
*   V(n036) = 9.5 V
*   V(n053) = 5.01 V
*   V(n061) = 2.504 V
*   V(n052) = 3.586 V
*   V(n028) = 2.504 V
*   V(n001) = 8.9 V
*   V(t) = 5.01 V
*   V(n026) = 2.504 V
*   V(n021) = 3.586 V
*   V(n059) = 2.504 V
*   V(n038) = 8.9 V
*   V(n041) = 9.039 V
*   V(n060) = 2.5 V
*   V(n002) = 9.024 V
*   V(n025) = 2.5 V
*   V(n017) = 5.494 V
*   V(n027) = 2.5 V
*   V(n022) = 3.508 V
*   V(n058) = 2.5 V
*   V(n051) = 3.586 V
*   V(n067) = 622.9 mV
*   V(n049) = 5.494 V
*   V(n007) = 1.899 V
*   V(n008) = 622.9 mV
*   V(n031) = 2.5 V
*   V(n018) = 5.373 V
*   V(n032) = 2.5 V
*   V(n048) = 5.494 V
*   V(n062) = 1.899 V
*   V(n035) = 9.5 V
*   V(n046) = 6.128 V
*   V(n016) = 6.001 V
*   V(vin) = 9.5 V
*   V(n015) = 6.128 V
*   V(n023) = 5.01 V
*   V(n045) = 6.128 V
*   V(n066) = 2.5 V
*   V(n057) = 2.504 V
*   V(n040) = 8.9 V
*   V(n055) = 5.01 V
*   I(R10) = -1.908 mA
*   Ic(Q23) = -561 µA
*   Ib(Q23) = -1.124 µA
*   Ie(Q23) = 562.1 µA
*   I(R23) = 1.043 mA
*   Ic(Q1) = 504.4 µA
*   Ib(Q1) = 991.5 nA
*   Ie(Q1) = -505.4 µA
*   I(R4) = -1.908 mA
*   Ic(Q41) = -561 µA
*   Ib(Q41) = -1.124 µA
*   Ie(Q41) = 562.1 µA
*   Ic(Q31) = -502.2 µA
*   Ib(Q31) = -1.129 µA
*   Ie(Q31) = 503.3 µA
*   I(RL3) = 200.4 mA
*   I(R25) = -1.252 mA
*   I(V1) = -2.087 mA
*   Ic(Q52) = 2.57 pA
*   Ib(Q52) = -3.995 pA
*   Ie(Q52) = 1.426 pA
*   I(V2) = -991.5 nA
*   I(R19) = 1.253 mA
*   Ic(Q48) = 1.682 mA
*   Ib(Q48) = 3.537 µA
*   Ie(Q48) = -1.686 mA
*   Ic(Q7) = 2.57 pA
*   Ib(Q7) = -3.995 pA
*   Ie(Q7) = 1.426 pA
*   I(R14) = -1.252 mA
*   Ic(Q38) = 558.3 µA
*   Ib(Q38) = 1.154 µA
*   Ie(Q38) = -559.5 µA
*   Ic(Q16) = 2.57 pA
*   Ib(Q16) = -3.995 pA
*   Ie(Q16) = 1.426 pA
*   Ic(Q28) = 504.4 µA
*   Ib(Q28) = 991.5 nA
*   Ie(Q28) = -505.4 µA
*   Ic(Q44) = 1.063 mA
*   Ib(Q44) = 2.295 µA
*   Ie(Q44) = -1.066 mA
*   Ic(Q54) = 1.038 mA
*   Ib(Q54) = 2.295 µA
*   Ie(Q54) = -1.041 mA
*   Ic(Q20) = 558.3 µA
*   Ib(Q20) = 1.154 µA
*   Ie(Q20) = -559.5 µA
*   Ic(Q12) = 1.682 mA
*   Ib(Q12) = 3.537 µA
*   Ie(Q12) = -1.686 mA
*   Ic(Q51) = -201.9 mA
*   Ib(Q51) = -1.682 mA
*   Ie(Q51) = 203.6 mA
*   Ic(Q26) = 1.063 mA
*   Ib(Q26) = 2.295 µA
*   Ie(Q26) = -1.066 mA
*   I(VIN5) = -154.2 mA
*   I(R22) = -1.908 mA
*   Ic(Q3) = 1.682 mA
*   Ib(Q3) = 3.537 µA
*   Ie(Q3) = -1.686 mA
*   Ic(Q18) = 1.038 mA
*   Ib(Q18) = 2.295 µA
*   Ie(Q18) = -1.041 mA
*   I(I2) = 150 mA
*   I(RL2) = 200.4 mA
*   Ic(Q9) = 1.038 mA
*   Ib(Q9) = 2.295 µA
*   Ie(Q9) = -1.041 mA
*   I(VIN3) = -154.2 mA
*   I(R31) = 1.908 mA
*   Ic(Q15) = -201.9 mA
*   Ib(Q15) = -1.682 mA
*   Ie(Q15) = 203.6 mA
*   I(V6) = -991.5 nA
*   I(Rs3) = 151.3 mA
*   Ic(Q50) = -560.2 µA
*   Ib(Q50) = -1.128 µA
*   Ie(Q50) = 561.3 µA
*   Ic(Q6) = -201.9 mA
*   Ib(Q6) = -1.682 mA
*   Ie(Q6) = 203.6 mA
*   Ic(Q34) = 2.57 pA
*   Ib(Q34) = -3.995 pA
*   Ie(Q34) = 1.426 pA
*   I(Rs5) = 151.3 mA
*   Ic(Q40) = -500.5 µA
*   Ib(Q40) = -1.126 µA
*   Ie(Q40) = 501.7 µA
*   I(R3) = 1.908 mA
*   I(R9) = 1.908 mA
*   Ic(Q30) = 1.682 mA
*   Ib(Q30) = 3.537 µA
*   Ie(Q30) = -1.686 mA
*   I(R28) = 1.043 mA
*   Ic(Q22) = -500.5 µA
*   Ib(Q22) = -1.126 µA
*   Ie(Q22) = 501.7 µA
*   Ic(Q14) = -560.2 µA
*   Ib(Q14) = -1.128 µA
*   Ie(Q14) = 561.3 µA
*   Ic(Q33) = -201.9 mA
*   Ib(Q33) = -1.682 mA
*   Ie(Q33) = 203.6 mA
*   I(R30) = -1.252 mA
*   I(R24) = 1.253 mA
*   Ic(Q5) = -560.2 µA
*   Ib(Q5) = -1.128 µA
*   Ie(Q5) = 561.3 µA
*   I(R17) = 1.043 mA
*   Ic(Q36) = 1.038 mA
*   Ib(Q36) = 2.295 µA
*   Ie(Q36) = -1.041 mA
*   I(I1) = 150 mA
*   I(R2) = -1.252 mA
*   Ic(Q53) = 1.063 mA
*   Ib(Q53) = 2.295 µA
*   Ie(Q53) = -1.066 mA
*   I(R13) = 1.253 mA
*   I(R8) = -1.252 mA
*   Ic(Q47) = 556.7 µA
*   Ib(Q47) = 1.148 µA
*   Ie(Q47) = -557.8 µA
*   Ic(Q37) = 502.8 µA
*   Ib(Q37) = 988.2 nA
*   Ie(Q37) = -503.8 µA
*   Ic(Q11) = 556.7 µA
*   Ib(Q11) = 1.148 µA
*   Ie(Q11) = -557.8 µA
*   I(R27) = -1.866 mA
*   Ic(Q2) = 556.7 µA
*   Ib(Q2) = 1.148 µA
*   Ie(Q2) = -557.8 µA
*   I(VIN6) = -204.6 mA
*   I(R21) = 1.908 mA
*   I(R16) = -1.866 mA
*   Ic(Q19) = 502.8 µA
*   Ib(Q19) = 988.2 nA
*   Ie(Q19) = -503.8 µA
*   I(V8) = -988.2 nA
*   Ic(Q17) = 1.063 mA
*   Ib(Q17) = 2.295 µA
*   Ie(Q17) = -1.066 mA
*   Ic(Q8) = 1.063 mA
*   Ib(Q8) = 2.295 µA
*   Ie(Q8) = -1.066 mA
*   Ic(Q32) = -560.2 µA
*   Ib(Q32) = -1.128 µA
*   Ie(Q32) = 561.3 µA
*   I(VIN2) = -204.6 mA
*   I(V4) = -988.2 nA
*   I(V9) = -1.043 mA
*   I(R20) = -1.252 mA
*   I(RL) = 200.4 mA
*   Ic(Q43) = 2.522 pA
*   Ib(Q43) = -4.026 pA
*   Ie(Q43) = 1.508 pA
*   I(VIN1) = -204.6 mA
*   I(RL1) = 200.4 mA
*   Ic(Q49) = -502.2 µA
*   Ib(Q49) = -1.129 µA
*   Ie(Q49) = 503.3 µA
*   I(Rs6) = 201.7 mA
*   I(Rs1) = 201.7 mA
*   Ic(Q21) = 1.299 mA
*   Ib(Q21) = 2.719 µA
*   Ie(Q21) = -1.302 mA
*   I(R33) = 1.043 mA
*   I(Rs2) = 201.7 mA
*   Ic(Q25) = 2.521 pA
*   Ib(Q25) = -4.025 pA
*   Ie(Q25) = 1.508 pA
*   Ic(Q29) = 556.7 µA
*   Ib(Q29) = 1.148 µA
*   Ie(Q29) = -557.8 µA
*   Ic(Q45) = 1.038 mA
*   Ib(Q45) = 2.295 µA
*   Ie(Q45) = -1.041 mA
*   Ic(Q39) = 1.299 mA
*   Ib(Q39) = 2.719 µA
*   Ie(Q39) = -1.302 mA
*   Ic(Q13) = -502.2 µA
*   Ib(Q13) = -1.129 µA
*   Ie(Q13) = 503.3 µA
*   Ic(Q42) = -151.8 mA
*   Ib(Q42) = -1.299 mA
*   Ie(Q42) = 153.1 mA
*   Ic(Q35) = 1.063 mA
*   Ib(Q35) = 2.295 µA
*   Ie(Q35) = -1.066 mA
*   I(R11) = 1.043 mA
*   Ic(Q27) = 1.038 mA
*   Ib(Q27) = 2.295 µA
*   Ie(Q27) = -1.041 mA
*   I(R29) = 1.253 mA
*   Ic(Q4) = -502.2 µA
*   Ib(Q4) = -1.129 µA
*   Ie(Q4) = 503.3 µA
*   I(R5) = 1.043 mA
*   I(V5) = -1.043 mA
*   I(R7) = 1.253 mA
*   Ic(Q24) = -151.8 mA
*   Ib(Q24) = -1.299 mA
*   Ie(Q24) = 153.1 mA
*   I(V7) = -1.043 mA
*   Ic(Q46) = 504.4 µA
*   Ib(Q46) = 991.5 nA
*   Ie(Q46) = -505.4 µA
*   I(VIN4) = -204.6 mA
*   I(R32) = -1.908 mA
*   I(R15) = 1.866 mA
*   I(V10) = -991.5 nA
*   I(R26) = 1.866 mA
*   I(Rs4) = 201.7 mA
*   Ic(Q10) = 504.4 µA
*   Ib(Q10) = 991.5 nA
*   Ie(Q10) = -505.4 µA
*   I(R1) = 1.253 mA
*   I(V3) = -1.043 mA